# Altium schematic sheet 2_I_O.schdoc
size 309 x 223 mm; Symbol: Sheet-Symbol_A4; Device: Sheet-Symbol_A4; Company: EasyEDA.com; Drawed: EasyEDA Pro; Reviewed: EasyEDA Pro; Version: V0.1; Page Size: A4; @Project Name: Robomama_ver000; @Page Count: 5; @Update Date: 2024-01-27; @Create Date: 2024-01-06; @Schematic Name: Robomama_Schematic; Part Number: JLCPCB-002; @Page No: 2; @Page Name: I/O
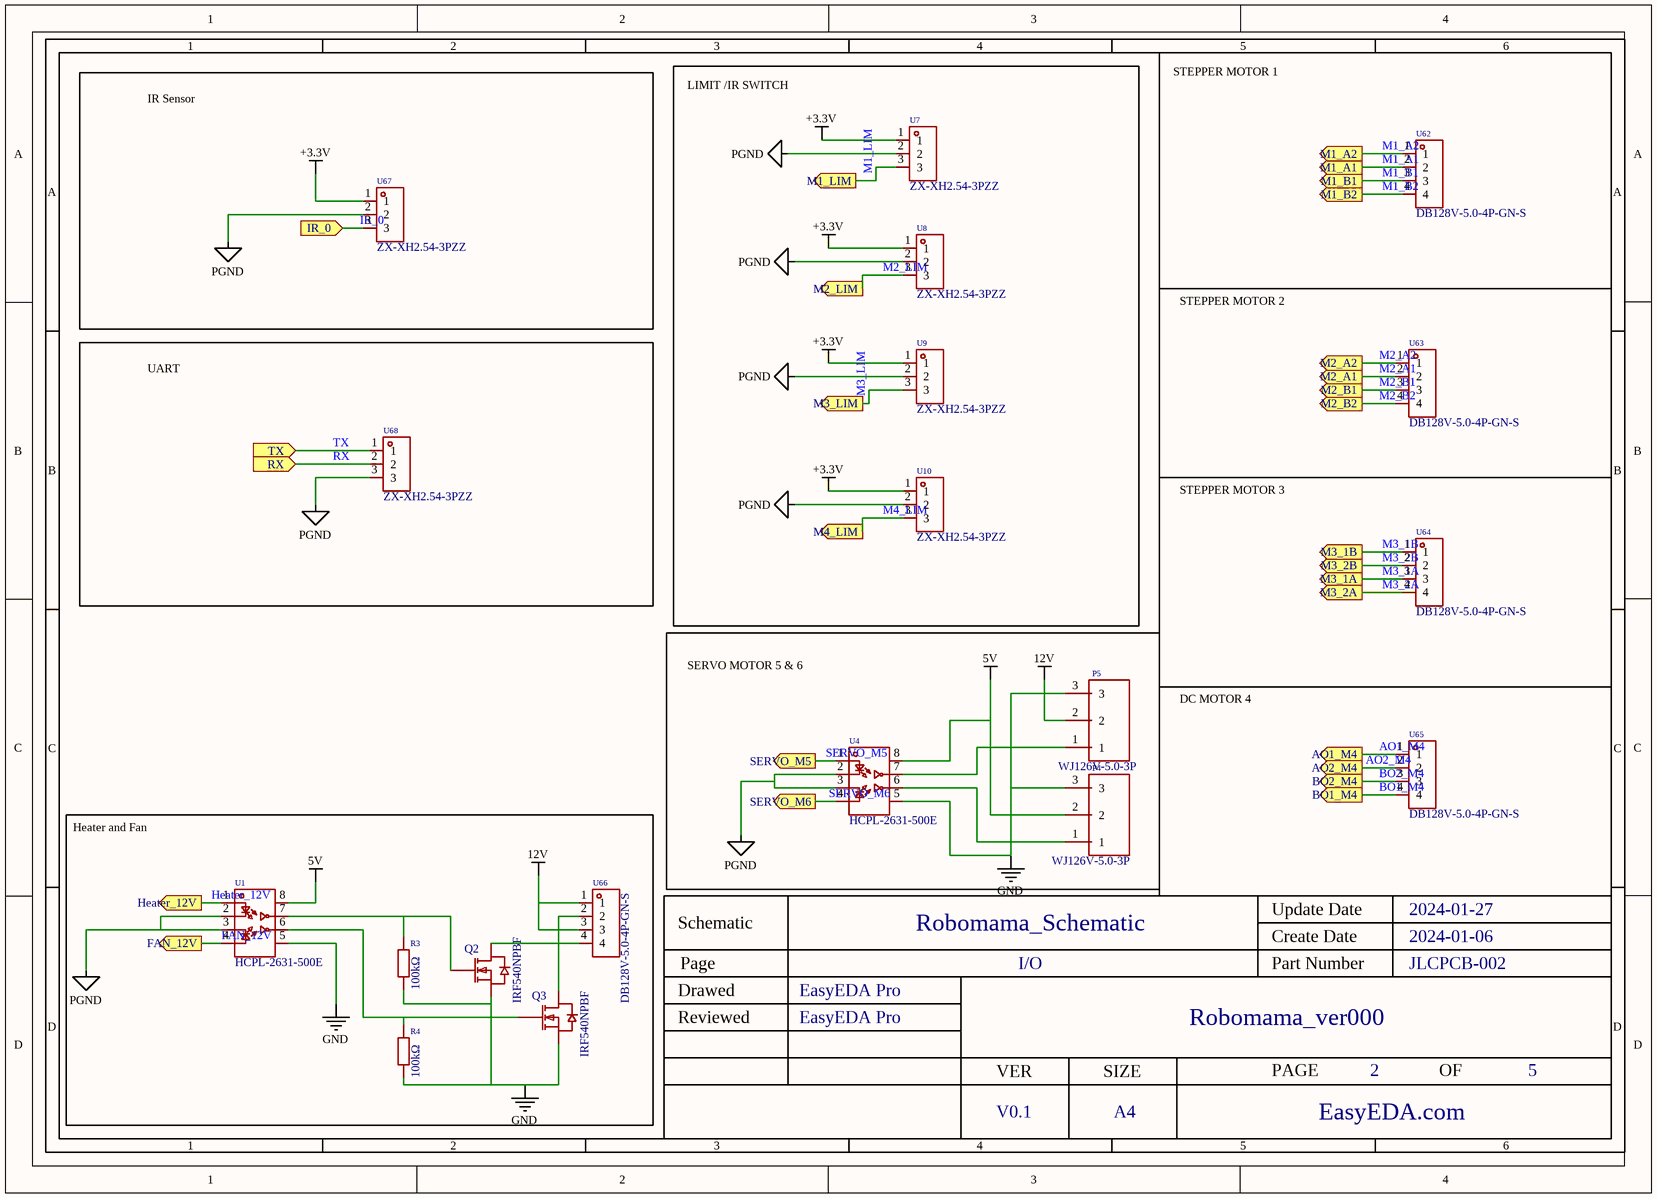
[diagram p0: 2_I_O.schdoc]

## Parts
P4  WJ126V-5.0-3P  [CONN-TH_3P-P5.00_WJ126V-5.0-3P]  (value not drawn)
P5  WJ126V-5.0-3P  [CONN-TH_3P-P5.00_WJ126V-5.0-3P]  (value not drawn)
Q2  IRF540NPBF  [TO-220-3_L10.0-W4.5-P2.54-L]  (value not drawn)
Q3  IRF540NPBF  [TO-220-3_L10.0-W4.5-P2.54-L]  (value not drawn)
R3  100kΩ  [R0603]  (value not drawn)
R4  100kΩ  [R0603]  (value not drawn)
U1  HCPL-2631-500E  [OPTO-SMD-8P_L9.7-W6.4-P2.54-LS9.7-BL]  (value not drawn)
U4  HCPL-2631-500E  [OPTO-SMD-8P_L9.7-W6.4-P2.54-LS9.7-BL]  (value not drawn)
U7  ZX-XH2.54-3PZZ  [CONN-TH_3P-P2.54_2501S-3P]  (value not drawn)
U8  ZX-XH2.54-3PZZ  [CONN-TH_3P-P2.54_2501S-3P]  (value not drawn)
U9  ZX-XH2.54-3PZZ  [CONN-TH_3P-P2.54_2501S-3P]  (value not drawn)
U10  ZX-XH2.54-3PZZ  [CONN-TH_3P-P2.54_2501S-3P]  (value not drawn)
U62  DB128V-5.0-4P-GN-S  [CONN-TH_DB128V-5.0-4P]  (value not drawn)
U63  DB128V-5.0-4P-GN-S  [CONN-TH_DB128V-5.0-4P]  (value not drawn)
U64  DB128V-5.0-4P-GN-S  [CONN-TH_DB128V-5.0-4P]  (value not drawn)
U65  DB128V-5.0-4P-GN-S  [CONN-TH_DB128V-5.0-4P]  (value not drawn)
U66  DB128V-5.0-4P-GN-S  [CONN-TH_DB128V-5.0-4P]  (value not drawn)
U67  ZX-XH2.54-3PZZ  [CONN-TH_3P-P2.54_2501S-3P]  (value not drawn)
U68  ZX-XH2.54-3PZZ  [CONN-TH_3P-P2.54_2501S-3P]  (value not drawn)

## Blocks framed on the sheet
IR Sensor: U67
LIMIT /IR SWITCH: U7-U10
UART: U68
SERVO MOTOR 5 & 6: P4 P5 U4
Heater and Fan: Q2 Q3 R3 R4 U1 U66

## Ports
AO1_M4 (out), AO2_M4 (out), BO1_M4 (out), BO2_M4 (out), FAN_12V (out), Heater_12V (out), IR_0 (in), M1_A1 (out), M1_A2 (out), M1_B1 (out), M1_B2 (out), M1_LIM (out), M2_A1 (out), M2_A2 (out), M2_B1 (out), M2_B2 (out), M2_LIM (out), M3_1A (out), M3_1B (out), M3_2A (out), M3_2B (out), M3_LIM (out), M4_LIM (out), RX (in), SERVO_M5 (out), SERVO_M6 (out), TX (in)

## Nets
5V: P4.2 U1.8(VCC) U4.8(VCC)
12V: P5.2 U66.1 U66.3
+3.3V: U7.1 U8.1 U9.1 U10.1 U67.1
GND: P4.3 P5.3 Q2.3(S) Q3.3(S) R3.1 R4.1 U1.5(GND) U4.5(GND)
PGND: U1.2(CATHODE_1) U1.3(CATHODE_2) U4.2(CATHODE_1) U4.3(CATHODE_2) U7.2 U8.2 U9.2 U10.2 U67.2 U68.3
AO1_M4: U65.1 ; port AO1_M4
AO2_M4: U65.2 ; port AO2_M4
BO1_M4: U65.4 ; port BO1_M4
BO2_M4: U65.3 ; port BO2_M4
FAN_12V: U1.4(ANODE_2) ; port FAN_12V
Heater_12V: U1.1(ANODE_1) ; port Heater_12V
IR_0: U67.3 ; port IR_0
M1_A1: U62.2 ; port M1_A1
M1_A2: U62.1 ; port M1_A2
M1_B1: U62.3 ; port M1_B1
M1_B2: U62.4 ; port M1_B2
M1_LIM: U7.3 ; port M1_LIM
M2_A1: U63.2 ; port M2_A1
M2_A2: U63.1 ; port M2_A2
M2_B1: U63.3 ; port M2_B1
M2_B2: U63.4 ; port M2_B2
M2_LIM: U8.3 ; port M2_LIM
M3_1A: U64.3 ; port M3_1A
M3_1B: U64.1 ; port M3_1B
M3_2A: U64.4 ; port M3_2A
M3_2B: U64.2 ; port M3_2B
M3_LIM: U9.3 ; port M3_LIM
M4_LIM: U10.3 ; port M4_LIM
RX: U68.2 ; port RX
SERVO_M5: U4.1(ANODE_1) ; port SERVO_M5
SERVO_M6: U4.4(ANODE_2) ; port SERVO_M6
TX: U68.1 ; port TX
NetP4_1: P4.1 U4.6(VO2)
NetP5_1: P5.1 U4.7(VO1)
NetQ2_1: Q2.1(G) R3.2 U1.7(VO1)
NetQ2_2: Q2.2(D) U66.4
NetQ3_1: Q3.1(G) R4.2 U1.6(VO2)
NetQ3_2: Q3.2(D) U66.2

## Notes on the sheet
- STEPPER MOTOR 1
- STEPPER MOTOR 2
- STEPPER MOTOR 3
- DC MOTOR 4
- 1
- 2
- 3
- 4
- 5
- 6
- A
- B
- C
- Schematic
- Robomama_Schematic
- Create Date
- Update Date
- 2024-01-27
- 2024-01-06
- Reviewed
- Drawed
- Page
- EasyEDA Pro
- I/O
- Part Number
- Robomama_ver000
- JLCPCB-002
- D
- VER
- SIZE
- PAGE
- OF
- V0.1
- A4
- EasyEDA.com

## Library data of the parts
P4 P5 = WJ126V-5.0-3P: Pitch:5mm Structure:1x3P Number of Rows:1 Number of PINs Per Row:3 Mounting Style:Straight Current Rating (Max):18A Voltage Rating (Max):250V Wire Gauge - AWG:14~26 Wire Gauge - AWG:14~26 Wire Gauge - mm2:2.5 Wire Gauge - mm2:2.5 Operating Temperature Ran; Manufacturer: KANGNEX(康奈克斯电气); Add into BOM: yes; Pitch: 5mm; Structure: 1x3P; Number of PINs Per Row: 3; Current Rating (Max): 18A; Voltage Rating (Max): 250V; Wire Gauge - AWG: 14~26; Wire Gauge - mm2: 2.5; Symbol: WJ126V-5.0-3P; Device: WJ126V-5.0-3P; Supplier: LCSC; Manufacturer Part: WJ126V-5.0-3P; Supplier Part: C8401; JLCPCB Part Class: Extended Part; LCSC Part Name: 5mm 1x3P 排数:1 每排P数:3 直插 可拼接; Supplier Footprint: 插件,P=5mm; Datasheet: https://atta.szlcsc.com/upload/public/pdf/source/20191225/C8401_BC4AEF85CCBF7CDF5CCE64583ADD1E63.pdf; Convert to PCB: yes; Number of Rows: 1; Mounting Style: Straight; Operating Temperature Range: -40℃~+105℃; Color: Green; Number of Pins: 3P
Q2 Q3 = IRF540NPBF: Type: Drain Source Voltage (Vdss): Continuous Drain Current (Id): Power Dissipation (Pd): Drain Source On Resistance (RDS(on)@Vgs,Id):44mΩ@10V,16A Gate Threshold Voltage (Vgs(th)@Id):4V@250uA Total Gate Charge (Qg@Vgs):71nC@10V Input Capacitance (Ciss@Vds; Manufacturer: Infineon(英飞凌); Add into BOM: yes; Input Capacitance (Ciss@Vds): 1960pF@25V; Symbol: IRF540NPBF; Device: IRF540NPBF; LCSC Part Name: N沟道 100V 33A; Supplier Part: C2566; Manufacturer Part: IRF540NPBF; Supplier Footprint: TO-220; JLCPCB Part Class: Extended Part; Datasheet: https://atta.szlcsc.com/upload/public/pdf/source/20140818/1457707225950.pdf; Supplier: LCSC; Convert to PCB: yes; Drain Source On Resistance (RDS(on)@Vgs,Id): 44mΩ@10V,16A; Gate Threshold Voltage (Vgs(th)@Id): 4V@250uA; Total Gate Charge (Qg@Vgs): 71nC@10V; Operating Temperature: -55℃~+175℃@(Tj)
R3 R4 = 0603WAF1003T5E: Resistance:100000Ω Tolerance:±1% Tolerance:±1% Power(Watts): Overload Voltage (Max): Temperature Coefficient:±100ppm/℃ Temperature Coefficient:±100ppm/℃ Type:Thick Film Resistors Operating Temperature Range:-55℃~+155℃ Operating Temperature Range:-55℃~+155; Manufacturer: UNI-ROYAL(厚声); Add into BOM: yes; Tolerance: ±1%; Symbol: 0603WAF1003T5E; Device: 0603WAF1003T5E; Supplier: LCSC; Manufacturer Part: 0603WAF1003T5E; Supplier Part: C25803; Value: 100kΩ; JLCPCB Part Class: Basic Part; LCSC Part Name: 100kΩ ±1% 100mW 厚膜电阻; Supplier Footprint: 0603; Datasheet: https://atta.szlcsc.com/upload/public/pdf/source/20200306/C422600_1E6D84923E4A46A82E41ADD87F860B5C.pdf; Convert to PCB: yes; Temperature Coefficient: ±100ppm/℃; Type: Thick Film Resistors; Operating Temperature Range: -55℃~+155℃
U1 U4 = HCPL-2631-500E: Input Type:DC Supply Voltage:4.5V~5.5V Supply Voltage:4.5V~5.5V Isolation Voltage(rms):3750V Common Mode Transient Immunity (CMTI):10kV/us Data Rate:10Mbit/s Propagation Delay tpLH/tpHL:100ns；100ns Number of Channels:2 Operating Temperature:-40℃~+85℃ Oper; Manufacturer: Broadcom/AVAGO(安华高); Add into BOM: yes; Input Type: DC; Isolation Voltage(rms): 3750V; Number of Channels: 2; Symbol: HCPL-2631-500E; Device: HCPL-2631-500E; Supplier: LCSC; Supplier Part: C188742; Manufacturer Part: HCPL-2631-500E; JLCPCB Part Class: Extended Part; LCSC Part Name: DC输入 2通道 隔离电压(rms):3750V; Supplier Footprint: SMD-8; Datasheet: https://atta.szlcsc.com/upload/public/pdf/source/20230529/B66ECE73AA068C74D68BEC5BB0D87132.pdf; Convert to PCB: yes; Supply Voltage: 4.5V~5.5V; Common Mode Transient Immunity (CMTI): 10kV/us; Data Rate: 10Mbit/s; Propagation Delay tpLH/tpHL: 100ns；100ns; Operating Temperature: -40℃~+85℃
U7-U10 U67 U68 = ZX-XH2.54-3PZZ: Pins Structure:1x3P Pitch:2.54mm Mounting Style:Straight Row Spacing:- Number of Pins:3P Number of Rows:1 Number of PINs Per Row:3 Reference Series:XH Current Rating (Max):3A Contact Material:Brass Contact Plating:Tin Operating Temperature Range:-25℃~+85℃; Manufacturer: Megastar(兆星); Add into BOM: yes; Pins Structure: 1x3P; Pitch: 2.54mm; Number of PINs Per Row: 3; Reference Series: XH; Current Rating (Max): 3A; Symbol: ZX-XH2.54-3PZZ; Device: ZX-XH2.54-3PZZ; Supplier: LCSC; Supplier Part: C7429633; Manufacturer Part: ZX-XH2.54-3PZZ; JLCPCB Part Class: Extended Part; LCSC Part Name: 1x3P 间距:2.54mm 直插 系列:XH; Supplier Footprint: 插件,P=2.54mm; Datasheet: https://atta.szlcsc.com/upload/public/pdf/source/20230619/AE17037A2CFDBE8D9CBA775D61AD0A84.pdf; Convert to PCB: yes; Mounting Style: Straight; Row Spacing: -; Number of Pins: 3P; Number of Rows: 1; Contact Material: Brass; Contact Plating: Tin; Operating Temperature Range: -25℃~+85℃
U62-U66 = DB128V-5.0-4P-GN-S: Pitch:5mm Structure:1x4P Number of Rows:1 Number of PINs Per Row:4 Mounting Style:Straight Current Rating (Max):20A Voltage Rating (Max):300V Wire Gauge - AWG:12~30 Wire Gauge - AWG:12~30 Wire Gauge - mm2:2.5 Wire Gauge - mm2:2.5 Operating Temperature Ran; Manufacturer: DIBO(地博电气); Add into BOM: yes; Pitch: 5mm; Structure: 1x4P; Number of PINs Per Row: 4; Current Rating (Max): 20A; Voltage Rating (Max): 300V; Wire Gauge - AWG: 12~30; Wire Gauge - mm2: 2.5; Symbol: DB128V-5.0-4P; Device: DB128V-5.0-4P-GN-S; Supplier: LCSC; Supplier Part: C424682; Manufacturer Part: DB128V-5.0-4P-GN-S; JLCPCB Part Class: Extended Part; LCSC Part Name: 5mm 1x4P 排数:1 每排P数:4 直插; Supplier Footprint: 插件,P=5mm; Datasheet: https://atta.szlcsc.com/upload/public/pdf/source/20230106/1C26AF647DE84A253DB7E5AA54EB19EE.pdf; Convert to PCB: yes; Number of Rows: 1; Mounting Style: Straight; Operating Temperature Range: -40℃~+105℃; Color: Green; Number of Pins: 4P